# Altium schematic sheet 7V_Buck.SchDoc
size A; SheetNumber: 5; SheetTotal: 10
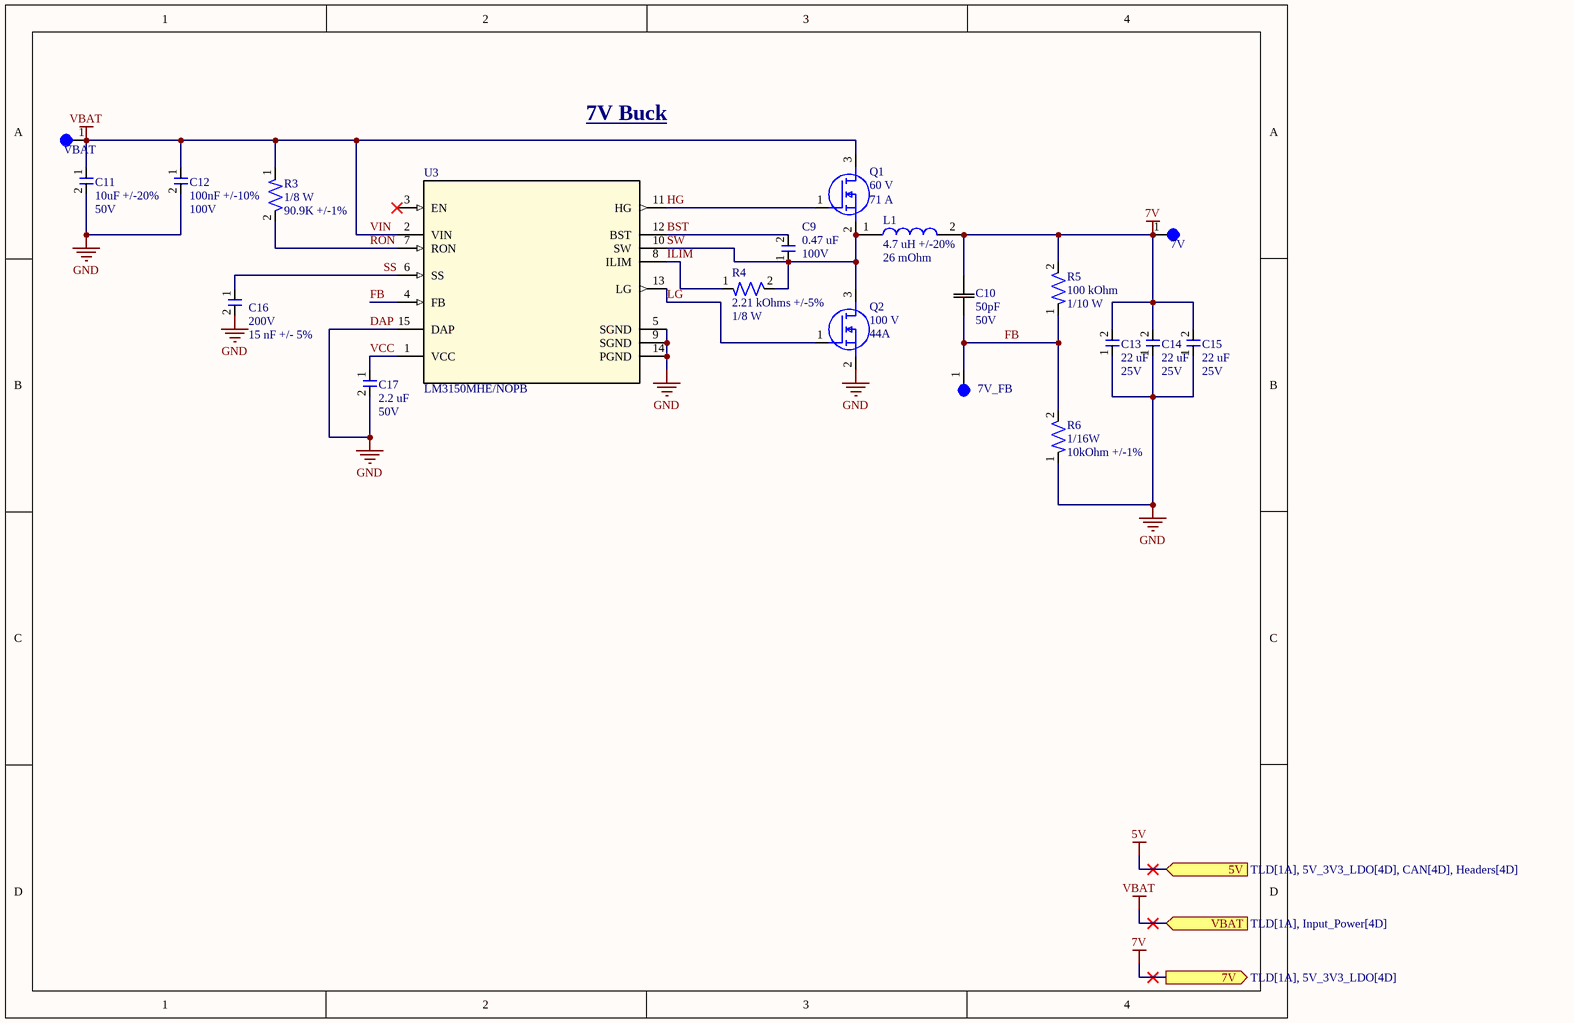
[diagram p0: 7V_Buck.SchDoc]

## Parts
7V  5003  [TEST-POINT-0001]  (value not drawn)
7V_FB  5003  [TEST-POINT-0001]  (value not drawn)
C9  Capacitance: 0.47 uF  Voltage: 100V  [CAP-0805]  (hidden comment: KAM21KR72A474KL)
C10  Capacitance: 50pF  Voltage: 50V  [CAP_CC0402_YAG]  (hidden comment: CC0402JRNPO9BN500)
C11  Capacitance: 10uF +/-20%  Voltage Rating: 50V  [CAP-1206]  (hidden comment: CL31B106KBHNNNE)
C12  Capacitance: 100nF +/-10%  Voltage Rating: 100V  [CAP-0603]  (hidden comment: CC0603KRX7R0BB104)
C13  Capacitance: 22 uF  Voltage: 25V  [CAP-1210]  (hidden comment: CL32B226KAJNNNE)
C14  Capacitance: 22 uF  Voltage: 25V  [CAP-1210]  (hidden comment: CL32B226KAJNNNE)
C15  Capacitance: 22 uF  Voltage: 25V  [CAP-1210]  (hidden comment: CL32B226KAJNNNE)
C16  Parameter 2: 200V  Parameter 1: 15 nF +/- 5%  [CAP-1206]  (hidden comment: GMC31CG153J200NT)
C17  Capacitance: 2.2 uF  oltage: 50V  [CAP-0603]  (hidden comment: UMK107BBJ225KA-T)
L1  Inductance: 4.7 uH +/-20%  DCR: 26 mOhm  [PWRIND-4.7U-0001]  (hidden comment: SRN6045TA-4R7M)
Q1  Max Voltage: 60 V  Max Current: 71 A  [NTMFS5C670NLT1G_ONS]  (hidden comment: NTMFS5C670NLT1G)
Q2  Voltage Max: 100 V  Current Max: 44A  [TRANS_CSD19534Q5A]  (hidden comment: CSD19534Q5A)
R3  Parameter 2: 1/8 W  Parameter 1: 90.9K +/-1%  [RES-0402]  (hidden comment: AC0402FR-7W90K9L)
R4  Resistance: 2.21 kOhms +/-5%  Power: 1/8 W  [RES-0805]  (hidden comment: RT0805BRD072K21L)
R5  Resistance: 100 kOhm  Power: 1/10 W  [RES-0603]  (hidden comment: RC0603FR-07100KL)
R6  Power Rating: 1/16W  Resistance: 10kOhm +/-1%  [RES-0402]  (hidden comment: RC0402FR-0710KL)
U3  LM3150MHE/NOPB  [MXA14A]
VBAT  5003  [TEST-POINT-0001]  (value not drawn)

## Ports
5V (in, see TLD[1A], 5V_3V3_LDO[4D], CAN[4D], Headers[4D]), 7V (out, see TLD[1A], 5V_3V3_LDO[4D]), VBAT (in, see TLD[1A], Input_Power[4D])

## Nets
5V: port 5V
7V: 7V.1 C10.2 C13.2 C14.2 C15.2 L1.2 R5.2 ; port 7V
DAP: C11.2 C12.2 C13.1 C14.1 C15.1 C16.2 C17.2 Q2.2(S) R6.1 U3.5(SGND) U3.9(SGND) U3.14(PGND) U3.15(DAP)  [also labelled GND]
VIN: C11.1 C12.1 Q1.3(D) R3.1 U3.2(VIN) VBAT.1 ; port VBAT  [also labelled VBAT]
BST: C9.2 U3.12(BST)
FB: 7V_FB.1 C10.1 R5.1 R6.2 U3.4(FB)
HG: Q1.1(G) U3.11(HG)
ILIM: R4.1 U3.8(ILIM)
LG: Q2.1(G) U3.13(LG)
RON: R3.2 U3.7(RON)
SS: C16.1 U3.6(SS)
SW: C9.1 L1.1 Q1.2(S) Q2.3(D) R4.2 U3.10(SW)
VCC: C17.1 U3.1(VCC)

Not connected (* = marked no-connect by the designer): U3 3(EN)*

## Notes on the sheet
- 7V Buck

## Library data of the parts
7V 7V_FB VBAT = TEST-POINT-0001: Oranange PC Test Point, Miniature Phoisphor Bronze Silver Plating Through Hole Mounting Type
C9 = CAP-0.47U-0001: 0.47 µF ±10% 100V Ceramic Capacitor X7R 0805 (2012 Metric); Tolerance: +/- 10%; Assembled?: No; Temperature Coefficient: X7R; Package Size: 0805
C10 = CAP-50p: 50 pF ±5% 50V Ceramic Capacitor C0G, NP0 0402 (1005 Metric); Manufacturer_Name: Yageo; Copyright: Copyright (C) 2025 Ultra Librarian. All rights reserved.; Manufacturer_Part_Number: CC0402JRNPO9BN500; ComponentLink1Description: Datasheet; ComponentLink1URL: https://www.yageo.com/en/Chart/Download/pdf/CC0402JRNPO9BN500
C11 = CAP-10U-0001: 10 µF ±10% 50V Ceramic Capacitor X7R 1206 (3216 Metric); Manufacturer: Samsung Electro-Mechanics; Assembled?: no; Manufacturer Part Number: CL31B106KBHNNNE; Temperature Coefficient: X7R; Package Size: 1206
C12 = CAP-100N-0001: CAP CER 0.1UF 100V X7R 0603; Manufacturer: YAGEO; Assembled?: no; Manufacturer Part Number: CC0603KRX7R0BB104; Temperature Coefficient: X7R; Package Size: 0603
C13-C15 = CAP-22U-0003: 22 µF ±10% 25V Ceramic Capacitor X7R 1210 (3225 Metric); Tolerance: +/- 10%; Assembled?: No; Temperature Coefficient: X7R; Package Size: 1210
C16 = CAP-15N-0001: 0.015 µF ±5% 200V Ceramic Capacitor C0G, NP0 1206 (3216 Metric)
C17 = CAP-2.2U-0001: 2.2 µF ±10% 50V Ceramic Capacitor X5R 0603 (1608 Metric)
L1 = PWRIND-4.7U-0001: 4.7 µH Semi-Shielded Drum Core, Wirewound Inductor 4.5 A 26mOhm Nonstandard; Saturation Current: 6.8A; Current Rating: 4.5A
Q1 = NMOS-71A-0001: N-Channel 60 V 17A (Ta), 71A (Tc) 3.6W (Ta), 61W (Tc) Surface Mount 5-DFN (5x6) (8-SOFL); Manufacturer_Name: onsemi; Copyright: Copyright (C) 2025 Ultra Librarian. All rights reserved.; Manufacturer_Part_Number: NTMFS5C670NLT1G; RefDes: RefDes; Type: Type
Q2 = NMOS-44A-0001: N-Channel 100 V 44A (Tc) 3.2W (Ta), 63W (Tc) Surface Mount 8-VSONP (5x6); MF: Texas Instruments; Mouser-Purchase-URL: https://snapeda.com/shop?store=Mouser&id=485742; Package: VSONP-8 Texas Instruments; Texas_Instruments-Purchase-URL: https://snapeda.com/shop?store=Texas+Instruments&id=485742; Value: *; Price: None; DigiKey-Purchase-URL: https://snapeda.com/shop?store=DigiKey&id=485742; MP: CSD19534Q5A; SnapEDA_Link: https://www.snapeda.com/parts/CSD19534Q5A/Texas%20Instruments/view-part/485742/?ref=snap; Availability: Good
R3 = RES-90.9K-0001: 90.9 kOhms ±1% 0.125W, 1/8W Chip Resistor 0402 (1005 Metric) Automotive AEC-Q200, Moisture Resistant Thick Film
R4 = RES-2.21K-0001: 2.21 kOhms ±0.1% 0.125W, 1/8W Chip Resistor 0805 (2012 Metric) Thin Film
R5 = RES-100K-0003: 100 kOhms ±1% 0.1W, 1/10W Chip Resistor 0603 (1608 Metric) Moisture Resistant Thick Film; Tolerance: +/- 1%; Assembled?: No; Package Size: 0603
R6 = RES-10K-0001: RES 10K OHM 1% 1/16W 0402; Manufacturer: YAGEO; Assembled?: no; Manufacturer Part Number: RC0402FR-0710KL; Package Size: 0402
U3 = IC-BUCK_0011: 6V to 42V Synchronous Step-Down Controller with Adjustable Output Voltage 14-HTSSOP -40 to 125; Manufacturer_Name: Texas Instruments; Copyright: Copyright (C) 2025 Ultra Librarian. All rights reserved.; Manufacturer_Part_Number: LM3150MHE/NOPB; Datasheet: https://www.ti.com/lit/gpn/lm3150; RefDes: RefDes; Type: Type